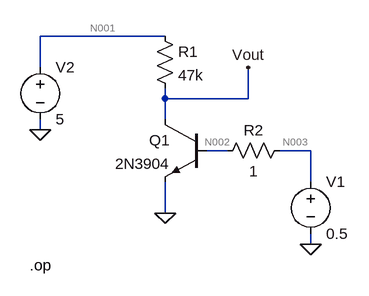
[diagram p0: schematic buddy_detect.asc]
buddy_detect.asc, the LTspice schematic file:
Version 4
SHEET 1 880 680
WIRE 96 80 -96 80
WIRE -96 128 -96 80
WIRE 96 176 96 160
WIRE 224 176 224 128
WIRE 224 176 96 176
WIRE 96 208 96 176
WIRE -96 224 -96 208
WIRE 192 256 160 256
WIRE 320 256 272 256
WIRE 320 304 320 256
WIRE 96 352 96 304
WIRE 320 400 320 384
FLAG 96 352 0
FLAG 320 400 0
FLAG -96 224 0
FLAG 224 128 Vout
SYMBOL npn 160 208 M0
SYMATTR InstName Q1
SYMATTR Value 2N3904
SYMBOL res 80 64 R0
SYMATTR InstName R1
SYMATTR Value 47k
SYMBOL voltage 320 288 R0
WINDOW 123 0 0 Left 0
WINDOW 39 0 0 Left 0
SYMATTR InstName V1
SYMATTR Value 0.5
SYMBOL res 176 272 R270
WINDOW 0 32 56 VTop 0
WINDOW 3 0 56 VBottom 0
SYMATTR InstName R2
SYMATTR Value 1
SYMBOL voltage -96 112 R0
WINDOW 123 0 0 Left 0
WINDOW 39 0 0 Left 0
SYMATTR InstName V2
SYMATTR Value 5
TEXT -112 432 Left 0 !.op

The netlist it stands for:
* buddy_detect.asc
Q1 Vout N002 0 0 2N3904
R1 N001 Vout 47k
V1 N003 0 0.5
R2 N002 N003 1
V2 N001 0 5
.model NPN NPN
.model PNP PNP
.lib standard.bjt
.op
.backanno
.end

* Results of the author's LTspice run, read from the files saved beside the schematic
* Operating Point:
*   V(vout) = 4.878 V
*   V(n002) = 500 mV
*   V(n001) = 5 V
*   V(n003) = 500 mV
*   Ic(Q1) = 2.594 µA
*   Ib(Q1) = 8.284 nA
*   Ie(Q1) = -2.603 µA
*   I(R2) = -8.284 nA
*   I(R1) = 2.594 µA
*   I(V2) = -2.594 µA
*   I(V1) = -8.284 nA
* From the log:
*   Semiconductor Device Operating Points:
*                           --- Bipolar Transistors ---
*   Name:       q1
*   Model:    2n3904
*   Ib:       8.28e-09
*   Ic:       2.59e-06
*   Vbe:      5.00e-01
*   Vbc:     -4.38e+00
*   Vce:      4.88e+00
*   BetaDC:   3.13e+02
*   Gm:       1.00e-04
*   Rpi:      3.12e+06
*   Rx:       2.00e+01
*   Ro:       4.02e+07
*   Cbe:      1.12e-11
*   Cbc:      2.12e-12
*   Cjs:      0.00e+00
*   BetaAC:   3.13e+02
*   Cbx:      0.00e+00
*   Ft:       1.20e+06